# EAGLE schematic LED_Panel (EAGLE 8.0.1)
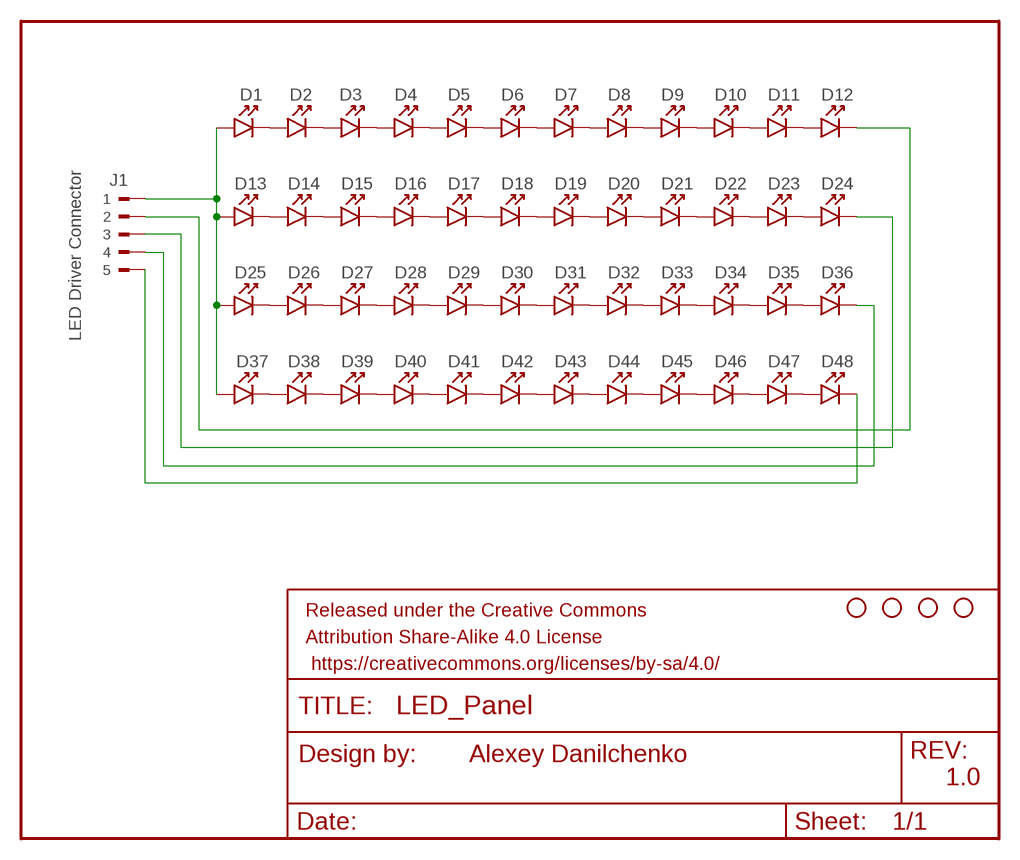
[diagram p0: schematic, sheet 1]

## Parts
D1  YUJI_D50  [YUJI_D50]
D2  YUJI_D50  [YUJI_D50]
D3  YUJI_D50  [YUJI_D50]
D4  YUJI_D50  [YUJI_D50]
D5  YUJI_D50  [YUJI_D50]
D6  YUJI_D50  [YUJI_D50]
D7  YUJI_D50  [YUJI_D50]
D8  YUJI_D50  [YUJI_D50]
D9  YUJI_D50  [YUJI_D50]
D10  YUJI_D50  [YUJI_D50]
D11  YUJI_D50  [YUJI_D50]
D12  YUJI_D50  [YUJI_D50]
D13  YUJI_D50  [YUJI_D50]
D14  YUJI_D50  [YUJI_D50]
D15  YUJI_D50  [YUJI_D50]
D16  YUJI_D50  [YUJI_D50]
D17  YUJI_D50  [YUJI_D50]
D18  YUJI_D50  [YUJI_D50]
D19  YUJI_D50  [YUJI_D50]
D20  YUJI_D50  [YUJI_D50]
D21  YUJI_D50  [YUJI_D50]
D22  YUJI_D50  [YUJI_D50]
D23  YUJI_D50  [YUJI_D50]
D24  YUJI_D50  [YUJI_D50]
D25  YUJI_D50  [YUJI_D50]
D26  YUJI_D50  [YUJI_D50]
D27  YUJI_D50  [YUJI_D50]
D28  YUJI_D50  [YUJI_D50]
D29  YUJI_D50  [YUJI_D50]
D30  YUJI_D50  [YUJI_D50]
D31  YUJI_D50  [YUJI_D50]
D32  YUJI_D50  [YUJI_D50]
D33  YUJI_D50  [YUJI_D50]
D34  YUJI_D50  [YUJI_D50]
D35  YUJI_D50  [YUJI_D50]
D36  YUJI_D50  [YUJI_D50]
D37  YUJI_D50  [YUJI_D50]
D38  YUJI_D50  [YUJI_D50]
D39  YUJI_D50  [YUJI_D50]
D40  YUJI_D50  [YUJI_D50]
D41  YUJI_D50  [YUJI_D50]
D42  YUJI_D50  [YUJI_D50]
D43  YUJI_D50  [YUJI_D50]
D44  YUJI_D50  [YUJI_D50]
D45  YUJI_D50  [YUJI_D50]
D46  YUJI_D50  [YUJI_D50]
D47  YUJI_D50  [YUJI_D50]
D48  YUJI_D50  [YUJI_D50]
FRAME1  FRAME-LEDGER  [CREATIVE_COMMONS]
J1  LED Driver Connector  TERMINAL_BLK_5  [TERMINAL_BLK_5X5MM]
STANDOFF1  STAND-OFF  [STAND-OFF]
STANDOFF2  STAND-OFF  [STAND-OFF]
STANDOFF3  STAND-OFF  [STAND-OFF]
STANDOFF4  STAND-OFF  [STAND-OFF]

## Nets
N$3: D1.ANODE D13.ANODE D25.ANODE D37.ANODE J1.1
N$4: D48.CATHODE J1.5
N$5: D29.CATHODE D30.ANODE
N$6: D5.CATHODE D6.ANODE
N$9: D37.CATHODE D38.ANODE
N$10: D36.CATHODE J1.4
N$19: D38.CATHODE D39.ANODE
N$20: D39.CATHODE D40.ANODE
N$21: D40.CATHODE D41.ANODE
N$22: D42.CATHODE D43.ANODE
N$23: D43.CATHODE D44.ANODE
N$24: D44.CATHODE D45.ANODE
N$25: D45.CATHODE D46.ANODE
N$26: D46.CATHODE D47.ANODE
N$27: D47.CATHODE D48.ANODE
N$28: D41.CATHODE D42.ANODE
N$29: D25.CATHODE D26.ANODE
N$30: D26.CATHODE D27.ANODE
N$31: D27.CATHODE D28.ANODE
N$32: D28.CATHODE D29.ANODE
N$33: D30.CATHODE D31.ANODE
N$34: D31.CATHODE D32.ANODE
N$35: D32.CATHODE D33.ANODE
N$36: D33.CATHODE D34.ANODE
N$37: D34.CATHODE D35.ANODE
N$38: D35.CATHODE D36.ANODE
N$39: D13.CATHODE D14.ANODE
N$40: D14.CATHODE D15.ANODE
N$41: D15.CATHODE D16.ANODE
N$42: D16.CATHODE D17.ANODE
N$43: D18.CATHODE D19.ANODE
N$44: D19.CATHODE D20.ANODE
N$45: D20.CATHODE D21.ANODE
N$46: D21.CATHODE D22.ANODE
N$47: D22.CATHODE D23.ANODE
N$48: D23.CATHODE D24.ANODE
N$49: D17.CATHODE D18.ANODE
N$50: D1.CATHODE D2.ANODE
N$51: D2.CATHODE D3.ANODE
N$52: D3.CATHODE D4.ANODE
N$53: D4.CATHODE D5.ANODE
N$54: D6.CATHODE D7.ANODE
N$55: D7.CATHODE D8.ANODE
N$56: D8.CATHODE D9.ANODE
N$57: D9.CATHODE D10.ANODE
N$58: D10.CATHODE D11.ANODE
N$59: D11.CATHODE D12.ANODE
N$60: D24.CATHODE J1.3
N$61: D12.CATHODE J1.2

## Notes on the sheet
- Alexey Danilchenko
- 1.0

## Library data of the parts
D1-D48 = Yuji_LED:YUJI_D50
FRAME1 = LEDS:FRAME-LEDGER: Schematic Frame Standard 11x14 US Ledger frame
J1 = WEIDMULLER-PM5.08_2_90BLK:TERMINAL_BLK_5: TERMINAL BLOCK, SIDE ENTRY, 2WAY
STANDOFF1-STANDOFF4 = Spectron2:STAND-OFF: #4 Stand Off This is the mechanical footprint for a #4 phillips button head screw. Use the keepout ring to avoid running the screw head into surrounding components. SKU : PRT-00447